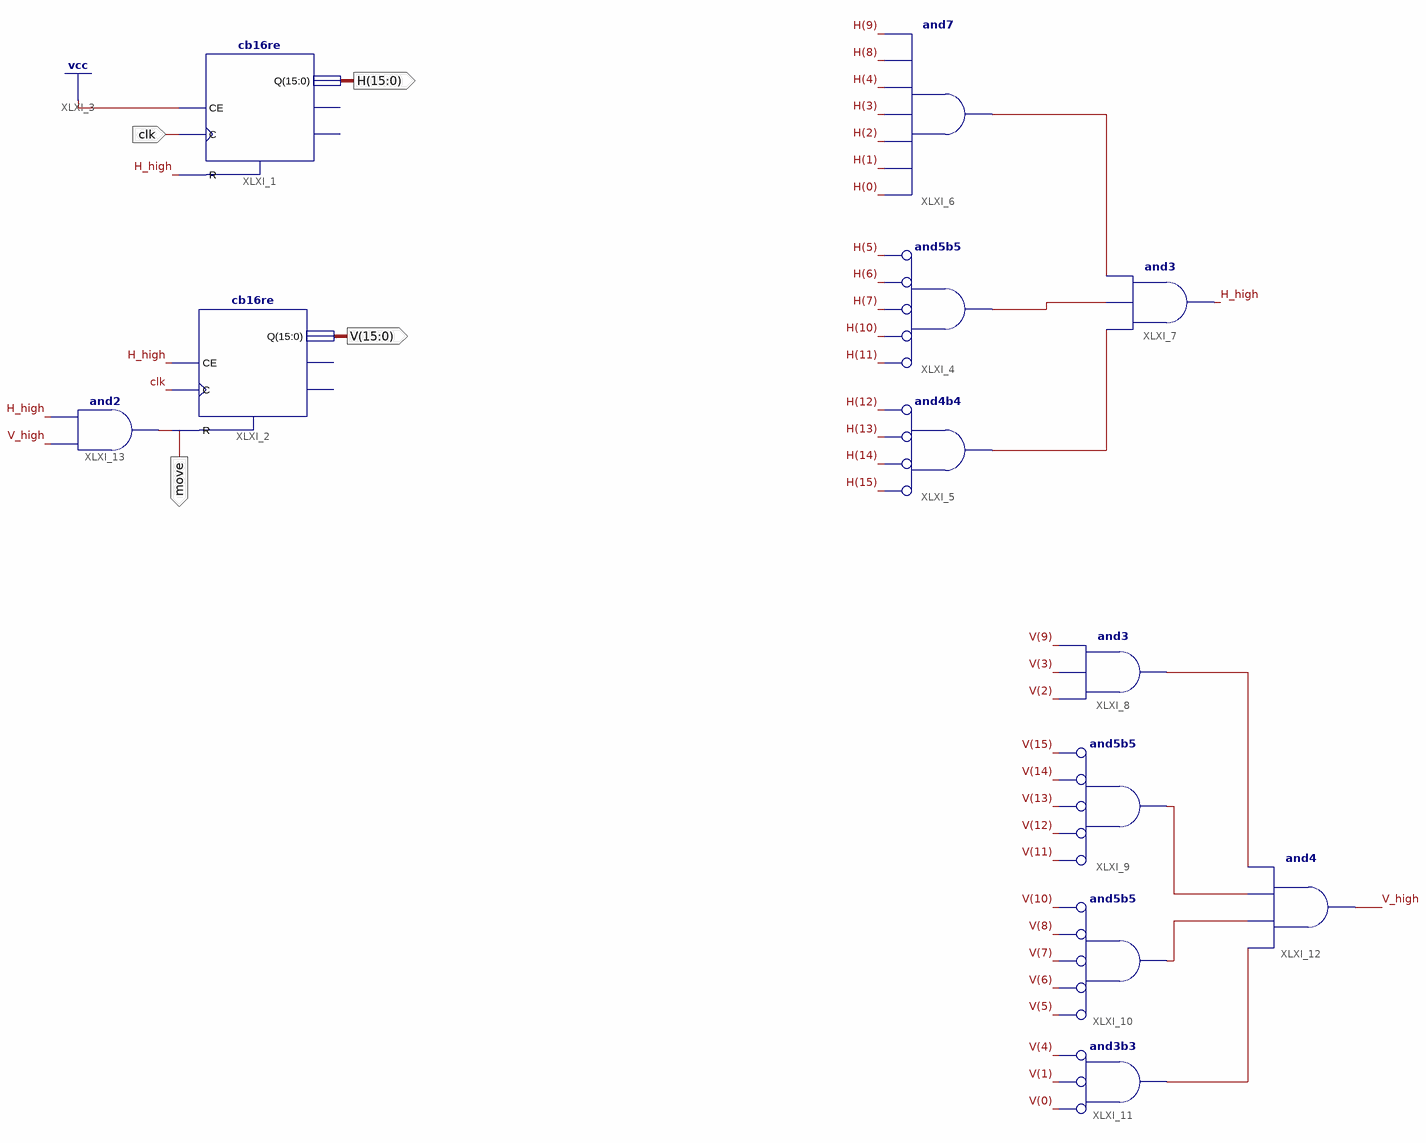
[diagram p0: schematic sheet 1]
// Xilinx ISE schematic Pix_Count.sch (spartan3e) as structural Verilog: 12 symbols, 4 ports
module Pix_Count (
  input  clk,
  output [15:0] H,
  output [15:0] V,
  output move
);

  wire frame, H_high, V_high, XLXN_7, XLXN_8, XLXN_9, XLXN_46, XLXN_47, XLXN_48, XLXN_49;

  and XLXI_4 (XLXN_8, ~H[11], ~H[10], ~H[7], ~H[6], ~H[5]);  // and5b5
  and XLXI_5 (XLXN_9, ~H[15], ~H[14], ~H[13], ~H[12]);  // and4b4
  and XLXI_6 (XLXN_7, H[0], H[1], H[2], H[3], H[4], H[8], H[9]);
  and XLXI_7 (H_high, XLXN_9, XLXN_8, XLXN_7);
  and XLXI_8 (XLXN_46, V[2], V[3], V[9]);
  and XLXI_9 (XLXN_47, ~V[11], ~V[12], ~V[13], ~V[14], ~V[15]);  // and5b5
  and XLXI_10 (XLXN_48, ~V[5], ~V[6], ~V[7], ~V[8], ~V[10]);  // and5b5
  and XLXI_11 (XLXN_49, ~V[0], ~V[1], ~V[4]);  // and3b3
  and XLXI_12 (V_high, XLXN_49, XLXN_48, XLXN_47, XLXN_46);
  cb16re XLXI_1 (.C(clk), .CE(1'b1), .R(H_high), .Q(H));  // open: CEO, TC
  cb16re XLXI_2 (.C(clk), .CE(H_high), .R(frame), .Q(V));  // open: CEO, TC
  and XLXI_13 (frame, V_high, H_high);
endmodule
